# Altium schematic sheet DMX.SchDoc
size A; DocumentNumber: 3; SheetNumber: 3; SheetTotal: 3
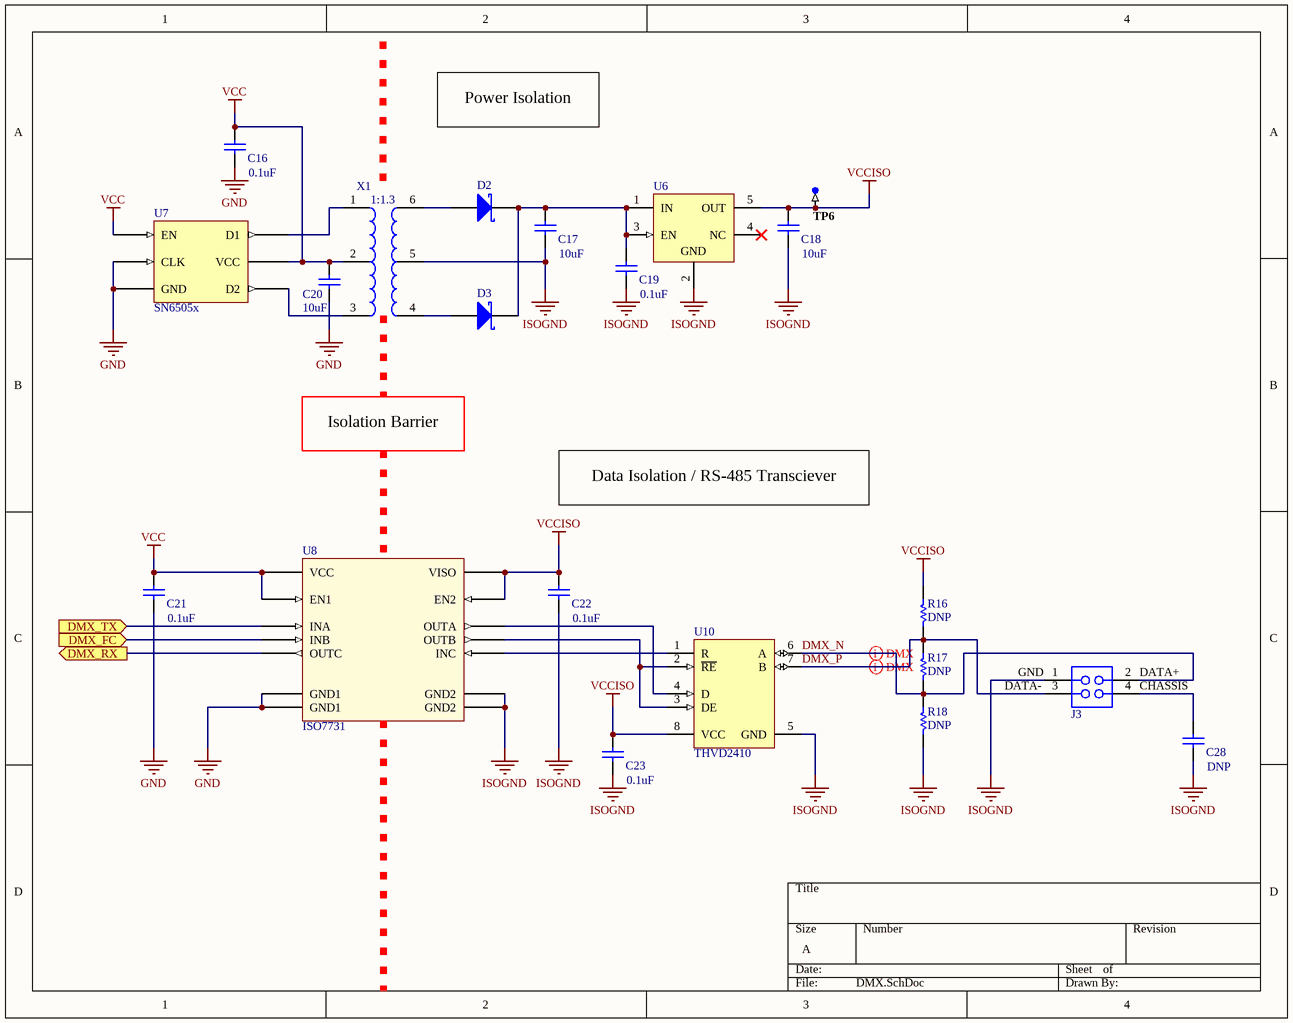
[diagram p0: DMX.SchDoc]

## Parts
C16  0.1uF  [CAPC0603(1608)100_L]
C17  10uF  [CAPC0603(1608)100_L]
C18  10uF  [CAPC0603(1608)100_L]
C19  0.1uF  [CAPC0603(1608)100_L]
C20  10uF  [CAPC0603(1608)100_L]
C21  0.1uF  [CAPC0603(1608)100_L]
C22  0.1uF  [CAPC0603(1608)100_L]
C23  0.1uF  [CAPC0603(1608)100_L]
C28  DNP  [CAPC0603(1608)100_L]
D2  MBR0520L  [ONSC-SOD-123-2-425-04_V]  (value not drawn)
D3  MBR0520L  [ONSC-SOD-123-2-425-04_V]  (value not drawn)
J3  SSM-102-F-DV  [SMTC-SSM-102-X-DV]  (value not drawn)
R16  DNP  [RESC0603(1608)_N]
R17  DNP  [RESC0603(1608)_N]
R18  DNP  [RESC0603(1608)_N]
TP6  TP-SM-C-100  [TP-SM-C-100]  (value not drawn)  (no BOM)
U6  TPS76333DBVTG4  [TI-DBV5_M]  (value not drawn)
U7  SN6505x  [SOT-23-6]
U8  ISO7731  [SOIC (16)]
U10  THVD2410  [D0008A_N]
X1  750313638  [750313638]  (value not drawn)

## Ports
DMX_FC (in), DMX_RX (out), DMX_TX (in)

## Nets
GND: C16.1 C20.1 C21.1 U7.4(GND) U7.6(CLK) U8.2(GND1) U8.8(GND1)
ISOGND: C17.1 C18.1 C19.1 C22.1 C23.1 C28.1 J3.1 R18.2 U6.2(GND) U8.9(GND2) U8.15(GND2) U10.5(GND) X1.5
VCC: C16.2 C20.2 C21.2 U7.2(VCC) U7.5(EN) U8.1(VCC) U8.7(EN1) X1.2
VCCISO: C18.2 C22.2 C23.2 R16.1 TP6.1 U6.5(OUT) U8.10(EN2) U8.16(VISO) U10.8(VCC)
DMX_FC: U8.4(INB) ; port DMX_FC
DMX_N: J3.2 R17.1 R18.1 U10.6(A)
DMX_P: J3.3 R16.2 R17.2 U10.7(B)
DMX_RX: U8.5(OUTC) ; port DMX_RX
DMX_TX: U8.3(INA) ; port DMX_TX
NetC17_2: C17.2 C19.2 D2.1(K) D3.1(K) U6.1(IN) U6.3(EN)
NetC28_2: C28.2 J3.4
NetD2_2: D2.2(A) X1.6
NetD3_2: D3.2(A) X1.4
NetU7_1: U7.1(D1) X1.1
NetU7_3: U7.3(D2) X1.3
NetU8_12: U8.12(INC) U10.1(R)
NetU8_13: U8.13(OUTB) U10.2(~{RE}) U10.3(DE)
NetU8_14: U8.14(OUTA) U10.4(D)

Not connected (* = marked no-connect by the designer): U6 4(NC)*; U8 6(NC) 11(NC)

## Layout directives
differential pair: DMX_N, DMX_P

## Notes on the sheet
- Power Isolation
- Isolation Barrier
- Data Isolation / RS-485 Transciever
- (near J3) DATA-
- (near J3) GND
- (near J3) DATA+
- CHASSIS
- (in symbol 750313638) 1:1.3

## Library data of the parts
C16-C23 C28 = CMP-1035-00873-1: CAP 27pF 16V ±0.5pF 0603 (1608 Metric) Thickness 1mm SMD; Tolerance: Â±0.5pF; Case-Metric: 1608; Case-EIA: 0603; Value: 27pF; Max Thickness: 1 mm; Rated Voltage: 16 V; Technology: SMT
D2 D3 = CMP-2000-04926-1: Schottky Diode, 20V, 0.2A, 2-pin SOD-123, RoHS, Tape and Reel; Manufacturer: FairchildSemiconductor; Peak Forward Voltage: 0.385V; Rad Hard: No; Peak Non-Repetitive Surge Current: 5.5A; Peak Average Forward Current: 0.5A; Peak Reverse Current: 250uA; Configuration: Single; Mounting: SurfaceMount; Operating Temperature: -65to125degC; Datasheet URL: https://datasheet.ciiva.com/5739/1684450-5739282.pdf; Package Reference: SOD-123-2-425-04; Package Description: 2-Pin Small Outline Diode, Body 2.69 x 1.6 mm; Type: SchottkyDiode; Datasheet Version: Rev. C0, 03/2012; Manufacturer URL: https://www.fairchildsemi.com/; Peak Reverse Repetitive Voltage: 20V; Package: 2SOD-123; Packaging: Tape&Reel; Category: Rectifier
J3 = CMP-1023-00199-1: Tiger Claw(TM) Surface Mount Socket, Vertical, -55 to 125 degC, 2.54 mm Pitch, 4-Pin, Female, RoHS; Manufacturer: Samtec; Pitch: 2.54 mm; PartNumber: SSM-102-F-DV; PackageDescription: .100 C.L. Double Vertical SMT Socket Strip; Orientation: Vertical; ComponentLink2URL: http://www.samtec.com/documents/webfiles/pdf/SSM_SM.PDF; RoHS: True; ComponentLink2Description: Datasheet; ComponentLink3Description: Package Specification; ComponentLink1URL: http://www.samtec.com; ComponentLink1Description: Manufacturer URL; PackageReference: SSM-102-X-DV; Temperature Range: -55 to 125 degC; Mounting Technology: Surface Mount; DatasheetVersion: F-214; ComponentLink3URL: http://www.samtec.com/documents/webfiles/cpdf/SSM-1XX-XXX-DV-XX-XX-X-XX-MKT.pdf; PackageVersion: AK, 3/2000
R16-R18 = CMP-1012-00133-1: 300K 0.1W 5% 0603 (1608 Metric)  SMD; Case-Metric: 1608; Case-EIA: 0603; Value: 300000.00 Ohm; Technology: SMT; Power: 0.1 W; Tolerance: 5 %
TP6 = CMP-0484-00002-2: Test Point, Surface Mount, Circular, Pad Diameter 1 mm; Manufacturer: No Vendor; PartNumber: TP-SM-C-100
U6 = CMP-0394-00562-1: Single Output LDO, 150 mA, Fixed 3.3 V Output, 2.7 to 10 V Input, with Low IQ, 5-pin SOT-23 (DBV), -40 to 125 degC, Green (RoHS & no Sb/Br); Manufacturer: Texas Instruments; Vin(Max)(V): 10; SubFamily: Single Channel LDO; Vout Adj(Max)(V): 3.3; Iq(Typ)(mA): 0.08; Accuracy(%): 3; Vin(Min)(V): 2.7; Vdo(Typ)(mV): 300; Iout(Max)(A): 0.15; PackageReference: DBV5; Eco-Plan: Green (RoHS & no Sb/Br); PackageDescription: 5-Pin Plastic Small Outline, Body 1.60 Ãƒâ€” 2.90 mm, Pitch 0.95 mm; Vout Adj(Min)(V): 3.3; DatasheetVersion: SLVS181H; ComponentLink2Description: Datasheet; ComponentLink3URL: http://www.ti.com/litv/pdf/mpds018i; Code_JEDEC: MO-178; ComponentLink1Description: Manufacturer URL; PackageVersion: 4073253-4/K; PartNumber: TPS76333DBVTG4; ComponentLink1URL: http://www.ti.com/; ComponentLink3Description: Package Specification; Mounting Technology: Surface Mount; ComponentLink2URL: http://www.ti.com/general/docs/lit/getliterature.tsp?genericPartNumber=TPS76333&fileType=pdf; Fixed Output Options(V): 3.3
U10 = CMP-0694-00003-2: 3.3 V Supply RS-485 with IEC ESD Protection, 20 Mbps, -40 to 125 degC, 8-Pin SOIC, RoHS, Tape and Reel; Manufacturer: Texas Instruments; PartNumber: SN65HVD75DR; ESD: 15 kV; ICC (Max) (mA): 0.95; No. of RX: 1; VCC: 3 to 3.6 V; VI: -7 to 12 V; Signaling Rate (Max) (Mbps): 20; ComponentLink2Description: Datasheet; ComponentLink3URL: http://www.ti.com/lit/ds/sllse11c/sllse11c.pdf; PackageVersion: 4040047-3/M; Operating Temperature Range: -40 to 125 degC; DatasheetVersion: SLLSE11C; ComponentLink1URL: http://www.ti.com/; Mounting Technology: Surface Mount; RoHS: TRUE; ComponentLink3Description: Package Specification; No. of TX: 1; Packing: Tape and Reel; PackageReference: D0008A; ComponentLink1Description: Manufacturer URL; ComponentLink2URL: http://www.ti.com/lit/ds/sllse11c/sllse11c.pdf; PackageDescription: 8-Pin Plastic Small Outline, Body 4.9 x 3.9 mm, Pitch 1.27 mm